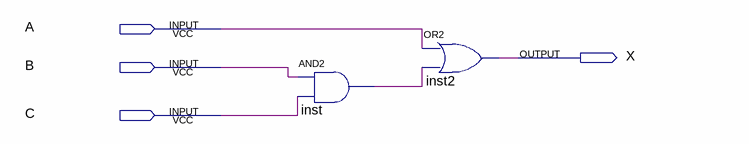
[diagram p0: schematic sheet]
// Quartus schematic semana1.bdf as structural Verilog: 2 symbols, 4 pins
module semana1 (
  input  A,
  input  B,
  input  C,
  output X
);

  wire inst_out;

  and inst (inst_out, B, C);
  or inst2 (X, A, inst_out);
endmodule
